# Altium project Control_Board.PrjPcb (part 2 of 7)

## Sheet Microcontroller.SchDoc
size A4; SheetNumber: 2; SheetTotal: 9
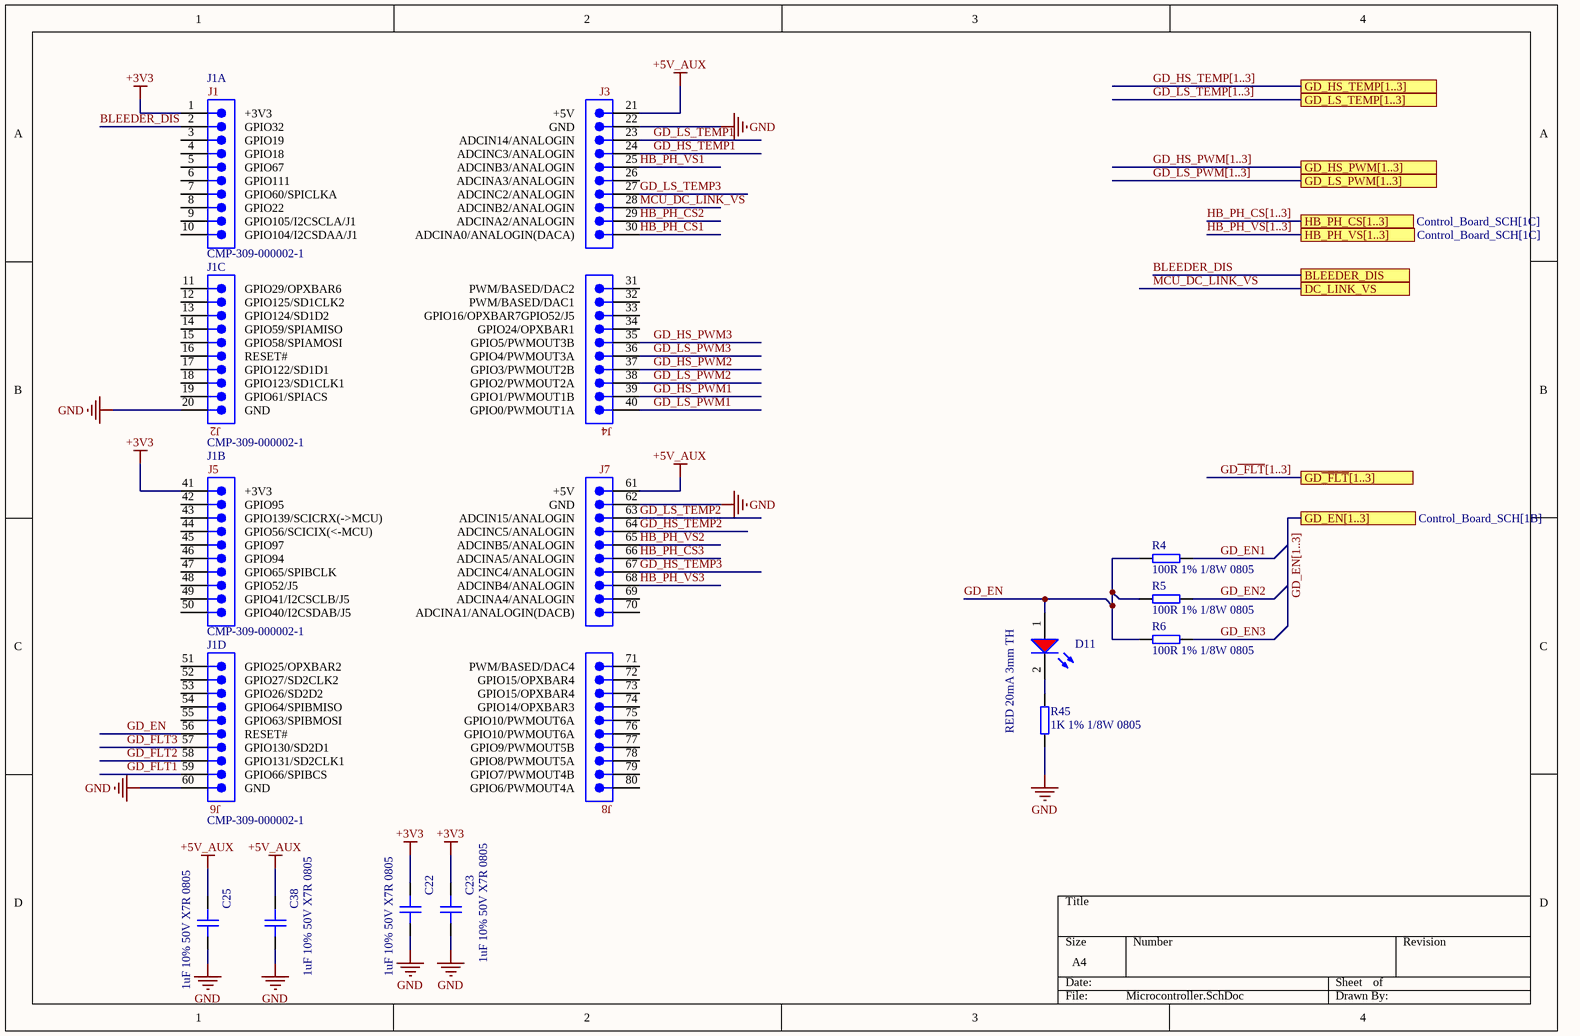
[diagram p2: Microcontroller.SchDoc]

### Parts
C22  1uF 10% 50V X7R 0805  [CAPC2012X10N]
C23  1uF 10% 50V X7R 0805  [CAPC2012X10N]
C25  1uF 10% 50V X7R 0805  [CAPC2012X10N]
C38  1uF 10% 50V X7R 0805  [CAPC2012X10N]
D11  RED 20mA 3mm TH  [WL-TMRC_D3.95H5.3]
J1  CMP-309-000002-1  [LAUNCHXL-F28379D]  (parts A,B,C,D of 4)
R4  100R 1% 1/8W 0805  [RESC2012X05N]
R5  100R 1% 1/8W 0805  [RESC2012X05N]
R6  100R 1% 1/8W 0805  [RESC2012X05N]
R45  1K 1% 1/8W 0805  [RESC2012X05N]

### Ports
BLEEDER_DIS (see Control_Board_SCH[1C], DC_Link[1B]), DC_LINK_VS (see Control_Board_SCH[1C], DC_Link_Sensing[1C]), GD_EN[1..3] (see Control_Board_SCH[1B]), GD_HS_PWM[1..3] (see Control_Board_SCH[1B]), GD_HS_TEMP[1..3] (see Control_Board_SCH[1B]), GD_LS_PWM[1..3] (see Control_Board_SCH[1B]), GD_LS_TEMP[1..3] (see Control_Board_SCH[1C]), GD~{_FLT}[1..3] (see Control_Board_SCH[1B]), HB_PH_CS[1..3] (see Control_Board_SCH[1C]), HB_PH_VS[1..3] (see Control_Board_SCH[1C])

### Nets
+3V3: C22.1 C23.1 J1.1(+3V3) J1.41(+3V3)
+5V_AUX: C25.1 C38.1 J1.21(+5V) J1.61(+5V)
GND: C22.2 C23.2 C25.2 C38.2 J1.20(GND) J1.22(GND) J1.60(GND) J1.62(GND) R45.1
BLEEDER_DIS: J1.2(GPIO32) ; port BLEEDER_DIS
GD~{_FLT}1: J1.59(GPIO66/SPIBCS)
GD~{_FLT}2: J1.58(GPIO131/SD2CLK1)
GD~{_FLT}3: J1.57(GPIO130/SD2D1)
GD_EN: D11.1(A) J1.56(RESET#) R4.1 R5.1 R6.1
GD_EN1: R4.2  [project net GD_EN]
GD_EN2: R5.2  [project net GD_EN]
GD_EN3: R6.2  [project net GD_EN]
GD_HS_PWM1: J1.39(GPIO1/PWMOUT1B)  [project net GD_HS_PWM]
GD_HS_PWM2: J1.37(GPIO3/PWMOUT2B)  [project net GD_HS_PWM]
GD_HS_PWM3: J1.35(GPIO5/PWMOUT3B)  [project net GD_HS_PWM]
GD_HS_TEMP1: J1.24(ADCINC3/ANALOGIN)  [project net GD_HS_TEMP]
GD_HS_TEMP2: J1.64(ADCINC5/ANALOGIN)  [project net GD_HS_TEMP]
GD_HS_TEMP3: J1.67(ADCINC4/ANALOGIN)  [project net GD_HS_TEMP]
GD_LS_PWM1: J1.40(GPIO0/PWMOUT1A)  [project net GD_LS_PWM]
GD_LS_PWM2: J1.38(GPIO2/PWMOUT2A)  [project net GD_LS_PWM]
GD_LS_PWM3: J1.36(GPIO4/PWMOUT3A)  [project net GD_LS_PWM]
GD_LS_TEMP1: J1.23(ADCIN14/ANALOGIN)  [project net GD_LS_TEMP]
GD_LS_TEMP2: J1.63(ADCIN15/ANALOGIN)  [project net GD_LS_TEMP]
GD_LS_TEMP3: J1.27(ADCINC2/ANALOGIN)  [project net GD_LS_TEMP]
HB_PH_CS1: J1.30(ADCINA0/ANALOGIN(DACA))  [project net HB_PH_CS]
HB_PH_CS2: J1.29(ADCINA2/ANALOGIN)  [project net HB_PH_CS]
HB_PH_CS3: J1.66(ADCINA5/ANALOGIN)  [project net HB_PH_CS]
HB_PH_VS1: J1.25(ADCINB3/ANALOGIN)  [project net HB_PH_VS]
HB_PH_VS2: J1.65(ADCINB5/ANALOGIN)  [project net HB_PH_VS]
HB_PH_VS3: J1.68(ADCINB4/ANALOGIN)  [project net HB_PH_VS]
MCU_DC_LINK_VS: J1.28(ADCINB2/ANALOGIN) ; port DC_LINK_VS
NetD11_2: D11.2(K) R45.2

Not connected (* = marked no-connect by the designer): J1 3(GPIO19) 4(GPIO18) 5(GPIO67) 6(GPIO111) 7(GPIO60/SPICLKA) 8(GPIO22) 9(GPIO105/I2CSCLA/J1) 10(GPIO104/I2CSDAA/J1) 11(GPIO29/OPXBAR6) 12(GPIO125/SD1CLK2) 13(GPIO124/SD1D2) 14(GPIO59/SPIAMISO) 15(GPIO58/SPIAMOSI) 16(RESET#) 17(GPIO122/SD1D1) 18(GPIO123/SD1CLK1) 19(GPIO61/SPIACS) 26(ADCINA3/ANALOGIN) 31(PWM/BASED/DAC2) 32(PWM/BASED/DAC1) 33(GPIO16/OPXBAR7GPIO52/J5) 34(GPIO24/OPXBAR1) 42(GPIO95) 43(GPIO139/SCICRX(->MCU)) 44(GPIO56/SCICIX(<-MCU)) 45(GPIO97) 46(GPIO94) 47(GPIO65/SPIBCLK) 48(GPIO52/J5) 49(GPIO41/I2CSCLB/J5) 50(GPIO40/I2CSDAB/J5) 51(GPIO25/OPXBAR2) 52(GPIO27/SD2CLK2) 53(GPIO26/SD2D2) 54(GPIO64/SPIBMISO) 55(GPIO63/SPIBMOSI) 69(ADCINA4/ANALOGIN) 70(ADCINA1/ANALOGIN(DACB)) 71(PWM/BASED/DAC4) 72(GPIO15/OPXBAR4) 73(GPIO15/OPXBAR4) 74(GPIO14/OPXBAR3) 75(GPIO10/PWMOUT6A) 76(GPIO10/PWMOUT6A) 77(GPIO9/PWMOUT5B) 78(GPIO8/PWMOUT5A) 79(GPIO7/PWMOUT4B) 80(GPIO6/PWMOUT4A)

### Buses and harness runs
bus GD_EN[1..3] = port GD_EN[1..3]
bus GD_HS_PWM[1..3] = port GD_HS_PWM[1..3]
bus GD_HS_TEMP[1..3] = port GD_HS_TEMP[1..3]
bus GD_LS_PWM[1..3] = port GD_LS_PWM[1..3]
bus GD_LS_TEMP[1..3] = port GD_LS_TEMP[1..3]
bus GD~{_FLT}[1..3] = port GD~{_FLT}[1..3]
bus HB_PH_CS[1..3] = port HB_PH_CS[1..3]
bus HB_PH_VS[1..3] = port HB_PH_VS[1..3]

### Notes on the sheet
- (in symbol CMP-309-000002-1, part A) J3
- (in symbol CMP-309-000002-1, part B) J5; J7
- (in symbol CMP-309-000002-1, part C) J2; J4
- (in symbol CMP-309-000002-1, part D) J6; J8

### Library data of the parts
C22 C23 C25 C38 = CMP-001-00047-1: Ceramic Capacitor, Multilayer, Ceramic, 50V, 10% +Tol, 10% -Tol, X7R, 15% TC, 1uF, Surface Mount, 0805; Manufacturer Part Number: C2012X7R1H105K125AB; Manufacturer Lifecycle Status: PRODUCTION; Manufacturer: TDK; Value: 1µF; Export Control Classification Number (ECCN) Code: EAR99; Case/Package: 0805; Max Length: 3.5mm; ComponentLink4Description: https://datasheet.octopart.com:443/C3216X7R1H106K160AC-TDK-datasheet-151546523.pdf?src-supplier=ODG+(Origin+Data+Global); ComponentLink1URL: https://datasheet.octopart.com:443/C3216X7R1H106K160AC-TDK-datasheet-175423548.pdf?src-supplier=TME; Category: Ceramic Capacitors; Voltage Rating (DC): 50V; Case Code (Metric): 2012; Lifecycle Status: Production; Height: 1.6mm; Design Item ID: 1uF 10% 50V X7R 0805; Min Length: 3.1mm; Min Operating Temperature: -55°C; Pricing: 100=3,09, 250=2,81, 500=2,35, 1000=2,2, 2000=1,97 (DKK); Width: 1.6mm; Voltage Rating: 50V; Stock: 26276; ComponentLink2Description: https://datasheet.octopart.com:443/C3216X7R1H106K160AC-TDK-datasheet-182135025.pdf?src-supplier=TME; Harmonized Tariff Schedule (HTS) Code: 8532.24.00.20; ComponentLink3Description: https://datasheet.octopart.com:443/C3216X7R1H106K160AC-TDK-datasheet-159617022.pdf?src-supplier=TME; Thickness: 1.6mm; Max Operating Temperature: 125°C; ComponentLink4URL: https://datasheet.octopart.com:443/C3216X7R1H106K160AC-TDK-datasheet-151546523.pdf?src-supplier=ODG+(Origin+Data+Global); Lead Free: Lead Free; ComponentLink3URL: https://datasheet.octopart.com:443/C3216X7R1H106K160AC-TDK-datasheet-159617022.pdf?src-supplier=TME; ComponentLink1Description: https://datasheet.octopart.com:443/C3216X7R1H106K160AC-TDK-datasheet-175423548.pdf?src-supplier=TME; Max Width: 1.9mm; Dielectric: X7R; RoHS: Compliant; China RoHS: Compliant; REACH SVHC: Yes; ComponentLink2URL: https://datasheet.octopart.com:443/C3216X7R1H106K160AC-TDK-datasheet-182135025.pdf?src-supplier=TME; Length: 3.2mm; ComponentLink5URL: https://datasheet.octopart.com/C3216X7R1H106K160AC-TDK-datasheet-41194876.pdf; Introduction Date: 2018-03-29; Dielectric Material: Ceramic; Min Width: 1.5mm; Number of Terminals: 2; Material: Ceramic; Source: MasterLibrary_SCH.SchLib; Mounting Technology: Surface Mount; ComponentLink5Description: https://datasheet.octopart.com/C3216X7R1H106K160AC-TDK-datasheet-41194876.pdf
D11 = CMP-007-00005-2: LED RED DIFFUSED 3MM ROUND T/H; Manufacturer: Wurth Elektronik; Manufacturer Part Number: 151031SS06000; Lens Style: Circular, Diffused, Round; Peak Wavelength: 650nm; Dominant Wavelength: 640nm; Max Reverse Voltage (DC): 5V; Luminous Intensity: 35mcd; Forward Voltage: 2.2V; Forward Current: 100mA; Max Operating Temperature: 85°C; Length: 3mm; Category: LEDs; RoHS: Compliant; Lens Size: 3mm; Height: 5.3mm; Test Current: 20mA; Color: Red; Min Operating Temperature: -40°C; Packaging: Bulk; Case/Package: Radial; Mount: Through Hole; REACH SVHC: Unknown
J1 = CMP-309-000002-1: F28379D LaunchPad™ development kit for C2000™ Delfino™ MCU; Manufacturer: Texas Instruments; Manufacturer Lifecycle Status: ACTIVE; Core Architecture: C2000; Number of Bits: 32; Manufacturer Part Number: LAUNCHXL-F28379D; Category: DSPs - Digital Signal Processors; Pricing: 1=46.8 (USD); Lifecycle Status: Production; Pins: 0; REACH SVHC: No; ComponentLink1URL: https://octopart.com:443/opatz8j6/c1?t=_qCjX2Wo53PZarO6BjGz1pzxvZLeCrbbVJACmNqqTvR3TEBVwYoGW-DXq5l11NPCyEyQmG2wH9P15DbxEwR5ZZHsyk33RBSXwUdEtCa7jNxIhSrryjNLEF-Vgre1piZzQz56aD2MK6QuEQpUtDRfErQs-_Fz2k06mrjKwHn2nJAT_YV2HxfigPUyr5srGnEy9lLlrNqGpcCNex5yYxUMkQXiFlqqbITrV8bFvInxDQ88sUGODQNtS64O8hVEwNdGa20kbIjdoqOBoaE1JHzrO901WwG08850-S2bXz9NSqERxo83_Q49v-k_oL6cPW0CHjrP4NMWOrNhAcehFalWX6jDFn3RYJBbH4wBv6PGCMA2lz1wT9CaKpwnDvEQJ5WJVjDawH1R7TR419iNQ7OBATXWz7I&src-supplier=Texas+Instruments; ComponentLink1Description: https://octopart.com:443/opatz8j6/c1?t=_qCjX2Wo53PZarO6BjGz1pzxvZLeCrbbVJACmNqqTvR3TEBVwYoGW-DXq5l11NPCyEyQmG2wH9P15DbxEwR5ZZHsyk33RBSXwUdEtCa7jNxIhSrryjNLEF-Vgre1piZzQz56aD2MK6QuEQpUtDRfErQs-_Fz2k06mrjKwHn2nJAT_YV2HxfigPUyr5srGnEy9lLlrNqGpcCNex5yYxUMkQXiFlqqbITrV8bFvInxDQ88sUGODQNtS64O8hVEwNdGa20kbIjdoqOBoaE1JHzrO901WwG08850-S2bXz9NSqERxo83_Q49v-k_oL6cPW0CHjrP4NMWOrNhAcehFalWX6jDFn3RYJBbH4wBv6PGCMA2lz1wT9CaKpwnDvEQJ5WJVjDawH1R7TR419iNQ7OBATXWz7I&src-supplier=Texas+Instruments; ComponentLink2URL: https://datasheet.octopart.com:443/LAUNCHXL-F28379D-Texas-Instruments-datasheet-152741484.pdf?src-supplier=ODG+(Origin+Data+Global); ComponentLink2Description: https://datasheet.octopart.com:443/LAUNCHXL-F28379D-Texas-Instruments-datasheet-152741484.pdf?src-supplier=ODG+(Origin+Data+Global); ComponentLink3URL: https://datasheet.octopart.com:443/LAUNCHXL-F28379D-Texas-Instruments-datasheet-67294821.pdf?src-supplier=element14+APAC; ComponentLink3Description: https://datasheet.octopart.com:443/LAUNCHXL-F28379D-Texas-Instruments-datasheet-67294821.pdf?src-supplier=element14+APAC; ComponentLink4URL: https://datasheet.octopart.com:443/LAUNCHXL-F28379D-Texas-Instruments-datasheet-103777603.pdf?src-supplier=TME; ComponentLink4Description: https://datasheet.octopart.com:443/LAUNCHXL-F28379D-Texas-Instruments-datasheet-103777603.pdf?src-supplier=TME; ComponentLink5URL: http://sigma.octopart.com:80/reach_statement/Texas-Instruments-company-64.pdf?src-supplier=Compliance+Statements; ComponentLink5Description: http://sigma.octopart.com:80/reach_statement/Texas-Instruments-company-64.pdf?src-supplier=Compliance+Statements; ComponentLink6URL: http://sigma.octopart.com:80/conflict_mineral_statement/Texas-Instruments-company-63.pdf?src-supplier=Compliance+Statements; ComponentLink6Description: http://sigma.octopart.com:80/conflict_mineral_statement/Texas-Instruments-company-63.pdf?src-supplier=Compliance+Statements; ComponentLink7URL: https://octopart.com:443/opatz8j6/c1?t=vmM5mUkauSidLfiIfngj-A2eh6SjcyeYQ_18RxJ-XgRT5PFLOln341s3Da68ti8m6yMC8JyHE5YCQ8oxmljwW8O_iXgryuhhxmjCmpHtdr4VDwYtt48MgbKj-slNB3Nj0mMH04CuEmFmw_fUmAswlWbCu5ZMAg5-39dPO4IMZ0IkEkvJqqV3lhWtLIq7mSnDMHN61-x5vEZotwGXpDkhXVPdiQUwVwsuDPl99fprXnUSUtNA7saaZFRkXjg1cuiRBuIcQzdWjl70NXHJ-qE7RXDui7Y0LCAu6IeHkA&src-supplier=Compliance+Statements; ComponentLink7Description: https://octopart.com:443/opatz8j6/c1?t=vmM5mUkauSidLfiIfngj-A2eh6SjcyeYQ_18RxJ-XgRT5PFLOln341s3Da68ti8m6yMC8JyHE5YCQ8oxmljwW8O_iXgryuhhxmjCmpHtdr4VDwYtt48MgbKj-slNB3Nj0mMH04CuEmFmw_fUmAswlWbCu5ZMAg5-39dPO4IMZ0IkEkvJqqV3lhWtLIq7mSnDMHN61-x5vEZotwGXpDkhXVPdiQUwVwsuDPl99fprXnUSUtNA7saaZFRkXjg1cuiRBuIcQzdWjl70NXHJ-qE7RXDui7Y0LCAu6IeHkA&src-supplier=Compliance+Statements; Quantity: 4; Design Item ID: CON80: LAUNCHXL-F28379D; Source: MasterLibrary_SCH.SchLib
R4-R6 = CMP-009-00668-1: Res Thick Film 0805 100 Ohm 1% 0.125W ±100ppm/°C Molded SMD Paper T/R; Manufacturer Part Number: RMCF0805FT100R; Manufacturer: Stackpole Electronics; Working Voltage: 150V; Power Rating: 125mW; Value: 100; Features: Automotive AEC-Q200; Lifecycle Status: Production; ComponentLink10URL: https://datasheet.octopart.com:443/RMCF0805FT10K0-Stackpole-Electronics-datasheet-11547379.pdf?src-supplier=Future+Electronics; Case Code (Metric): 2012; ComponentLink16URL: http://sigma.octopart.com:80/141158211/reach_statement/Stackpole-Electronics-RMCF0805FT10K0.pdf?src-supplier=Compliance+Statements; ComponentLink14URL: https://datasheet.octopart.com:443/RMCF0805FT10K0-Stackpole-Electronics-datasheet-5313682.pdf?src-supplier=Future+Electronics; ComponentLink6URL: https://datasheet.octopart.com:443/RMCF0805FT10K0-Stackpole-Electronics-datasheet-62091608.pdf?src-supplier=Stackpole+Electronics; ComponentLink3URL: https://datasheet.octopart.com:443/RMCF0805FT10K0-Stackpole-Electronics-datasheet-28504820.pdf?src-supplier=Upverter; Design Item ID: 100R 1% 1/8W 0805; Mounting Technology: Surface Mount; ComponentLink9URL: https://datasheet.octopart.com:443/RMCF0805FT10K0-Stackpole-Electronics-datasheet-11546843.pdf?src-supplier=Arrow+Electronics; ComponentLink2Description: https://datasheet.octopart.com:443/RMCF0805FT10K0-Stackpole-Electronics-datasheet-12534581.pdf?src-supplier=Upverter; Voltage Rating: 150V; ComponentLink17Description: http://sigma.octopart.com:80/141158212/rohs_statement/Stackpole-Electronics-RMCF0805FT10K0.pdf?src-supplier=Compliance+Statements; Stock: 3420000; Number of Terminations: 2; Contact Plating: Tin; ComponentLink1Description: https://datasheet.octopart.com:443/RMCF0805FT10K0-Stackpole-Electronics-datasheet-182148065.pdf?src-supplier=IHS; ComponentLink2URL: https://datasheet.octopart.com:443/RMCF0805FT10K0-Stackpole-Electronics-datasheet-12534581.pdf?src-supplier=Upverter; Source: MasterLibrary_SCH.SchLib; Length: 2mm; ComponentLink13Description: https://datasheet.octopart.com:443/RMCF0805FT10K0-Stackpole-Electronics-datasheet-8088878.pdf?src-supplier=Future+Electronics; Lead Free: Lead Free; Category: Chip SMD Resistors; Composition: Thick Film; Tolerance: 1%; Schedule B: 8533210045, 8533210045; RoHS: Compliant; ComponentLink15URL: http://sigma.octopart.com:80/15940719/materials_sheet/Stackpole-Electronics-RMCF0805FT10K0.pdf?src-supplier=Compliance+Statements; Case/Package: 0805; Pricing: 5000=0.00245, 10000=0.00241, 20000=0.00238, 40000=0.00234, 80000=0.0023 (USD); ComponentLink8Description: https://datasheet.octopart.com:443/RMCF0805FT10K0-Stackpole-Electronics-datasheet-154799224.pdf?src-supplier=Master+Electronics; ComponentLink11Description: https://datasheet.octopart.com:443/RMCF0805FT10K0-Stackpole-Electronics-datasheet-8359789.pdf?src-supplier=Future+Electronics; China RoHS: Non-Compliant; Height: 500µm; ComponentLink9Description: https://datasheet.octopart.com:443/RMCF0805FT10K0-Stackpole-Electronics-datasheet-11546843.pdf?src-supplier=Arrow+Electronics; ComponentLink8URL: https://datasheet.octopart.com:443/RMCF0805FT10K0-Stackpole-Electronics-datasheet-154799224.pdf?src-supplier=Master+Electronics; ComponentLink12Description: https://datasheet.octopart.com:443/RMCF0805FT10K0-Stackpole-Electronics-datasheet-8324226.pdf?src-supplier=Future+Electronics; Temperature Coefficient: 100ppm/°C; ComponentLink12URL: https://datasheet.octopart.com:443/RMCF0805FT10K0-Stackpole-Electronics-datasheet-8324226.pdf?src-supplier=Future+Electronics; Number of Terminals: 2; Depth: 1.25mm; ComponentLink7Description: https://datasheet.octopart.com:443/RMCF0805FT10K0-Stackpole-Electronics-datasheet-10788263.pdf?src-supplier=Stackpole+Electronics; ComponentLink15Description: http://sigma.octopart.com:80/15940719/materials_sheet/Stackpole-Electronics-RMCF0805FT10K0.pdf?src-supplier=Compliance+Statements; ComponentLink6Description: https://datasheet.octopart.com:443/RMCF0805FT10K0-Stackpole-Electronics-datasheet-62091608.pdf?src-supplier=Stackpole+Electronics; Packaging: Cut Tape (CT); Max Operating Temperature: 155°C; ComponentLink7URL: https://datasheet.octopart.com:443/RMCF0805FT10K0-Stackpole-Electronics-datasheet-10788263.pdf?src-supplier=Stackpole+Electronics; ComponentLink16Description: http://sigma.octopart.com:80/141158211/reach_statement/Stackpole-Electronics-RMCF0805FT10K0.pdf?src-supplier=Compliance+Statements; Width: 1.25mm; Power Dissipation: 125mW; ComponentLink5Description: https://datasheet.octopart.com:443/RMCF0805FT10K0-Stackpole-Electronics-datasheet-141193804.pdf?src-supplier=Stackpole+Electronics; Radiation Hardening: No; Military Standard: Not; Min Operating Temperature: -55°C; ComponentLink11URL: https://datasheet.octopart.com:443/RMCF0805FT10K0-Stackpole-Electronics-datasheet-8359789.pdf?src-supplier=Future+Electronics; ComponentLink3Description: https://datasheet.octopart.com:443/RMCF0805FT10K0-Stackpole-Electronics-datasheet-28504820.pdf?src-supplier=Upverter; REACH SVHC: Yes; ComponentLink4Description: https://datasheet.octopart.com:443/RMCF0805FT10K0-Stackpole-Electronics-datasheet-12510902.pdf?src-supplier=Upverter; ComponentLink10Description: https://datasheet.octopart.com:443/RMCF0805FT10K0-Stackpole-Electronics-datasheet-11547379.pdf?src-supplier=Future+Electronics; ComponentLink5URL: https://datasheet.octopart.com:443/RMCF0805FT10K0-Stackpole-Electronics-datasheet-141193804.pdf?src-supplier=Stackpole+Electronics; Max Power Dissipation: 125mW; ComponentLink13URL: https://datasheet.octopart.com:443/RMCF0805FT10K0-Stackpole-Electronics-datasheet-8088878.pdf?src-supplier=Future+Electronics; ComponentLink17URL: http://sigma.octopart.com:80/141158212/rohs_statement/Stackpole-Electronics-RMCF0805FT10K0.pdf?src-supplier=Compliance+Statements; ComponentLink14Description: https://datasheet.octopart.com:443/RMCF0805FT10K0-Stackpole-Electronics-datasheet-5313682.pdf?src-supplier=Future+Electronics; ComponentLink4URL: https://datasheet.octopart.com:443/RMCF0805FT10K0-Stackpole-Electronics-datasheet-12510902.pdf?src-supplier=Upverter; ComponentLink1URL: https://datasheet.octopart.com:443/RMCF0805FT10K0-Stackpole-Electronics-datasheet-182148065.pdf?src-supplier=IHS
R45 = CMP-009-00648-1: Res Thick Film 0805 1K Ohm 1% 0.125W ±100ppm/°C Molded SMD Paper T/R; Manufacturer: Stackpole Electronics; Manufacturer Part Number: RMCF0805FT1K00; Power Dissipation: 125mW; Working Voltage: 150V; ComponentLink4Description: https://datasheet.octopart.com:443/RMCF0805FT10K0-Stackpole-Electronics-datasheet-12510902.pdf?src-supplier=Upverter; Tolerance: 1%; ComponentLink7Description: https://datasheet.octopart.com:443/RMCF0805FT10K0-Stackpole-Electronics-datasheet-10788263.pdf?src-supplier=Stackpole+Electronics; Category: Chip SMD Resistors; Pricing: 5000=0.00245, 10000=0.00241, 20000=0.00238, 40000=0.00234, 80000=0.0023 (USD); RoHS: Compliant; Packaging: Cut Tape (CT); Width: 1.25mm; ComponentLink12URL: https://datasheet.octopart.com:443/RMCF0805FT10K0-Stackpole-Electronics-datasheet-8324226.pdf?src-supplier=Future+Electronics; Temperature Coefficient: 100ppm/°C; Lifecycle Status: Production; Mounting Technology: Surface Mount; ComponentLink6Description: https://datasheet.octopart.com:443/RMCF0805FT10K0-Stackpole-Electronics-datasheet-62091608.pdf?src-supplier=Stackpole+Electronics; Number of Terminals: 2; ComponentLink1Description: https://datasheet.octopart.com:443/RMCF0805FT10K0-Stackpole-Electronics-datasheet-182148065.pdf?src-supplier=IHS; REACH SVHC: Yes; ComponentLink4URL: https://datasheet.octopart.com:443/RMCF0805FT10K0-Stackpole-Electronics-datasheet-12510902.pdf?src-supplier=Upverter; Power Rating: 125mW; Value: 1k; ComponentLink13URL: https://datasheet.octopart.com:443/RMCF0805FT10K0-Stackpole-Electronics-datasheet-8088878.pdf?src-supplier=Future+Electronics; ComponentLink10Description: https://datasheet.octopart.com:443/RMCF0805FT10K0-Stackpole-Electronics-datasheet-11547379.pdf?src-supplier=Future+Electronics; ComponentLink12Description: https://datasheet.octopart.com:443/RMCF0805FT10K0-Stackpole-Electronics-datasheet-8324226.pdf?src-supplier=Future+Electronics; ComponentLink2Description: https://datasheet.octopart.com:443/RMCF0805FT10K0-Stackpole-Electronics-datasheet-12534581.pdf?src-supplier=Upverter; Number of Terminations: 2; ComponentLink17URL: http://sigma.octopart.com:80/141158212/rohs_statement/Stackpole-Electronics-RMCF0805FT10K0.pdf?src-supplier=Compliance+Statements; Contact Plating: Tin; ComponentLink9URL: https://datasheet.octopart.com:443/RMCF0805FT10K0-Stackpole-Electronics-datasheet-11546843.pdf?src-supplier=Arrow+Electronics; ComponentLink17Description: http://sigma.octopart.com:80/141158212/rohs_statement/Stackpole-Electronics-RMCF0805FT10K0.pdf?src-supplier=Compliance+Statements; ComponentLink2URL: https://datasheet.octopart.com:443/RMCF0805FT10K0-Stackpole-Electronics-datasheet-12534581.pdf?src-supplier=Upverter; Case Code (Metric): 2012; ComponentLink8Description: https://datasheet.octopart.com:443/RMCF0805FT10K0-Stackpole-Electronics-datasheet-154799224.pdf?src-supplier=Master+Electronics; ComponentLink11Description: https://datasheet.octopart.com:443/RMCF0805FT10K0-Stackpole-Electronics-datasheet-8359789.pdf?src-supplier=Future+Electronics; ComponentLink5Description: https://datasheet.octopart.com:443/RMCF0805FT10K0-Stackpole-Electronics-datasheet-141193804.pdf?src-supplier=Stackpole+Electronics; ComponentLink11URL: https://datasheet.octopart.com:443/RMCF0805FT10K0-Stackpole-Electronics-datasheet-8359789.pdf?src-supplier=Future+Electronics; Height: 500µm; ComponentLink1URL: https://datasheet.octopart.com:443/RMCF0805FT10K0-Stackpole-Electronics-datasheet-182148065.pdf?src-supplier=IHS; Length: 2mm; ComponentLink16Description: http://sigma.octopart.com:80/141158211/reach_statement/Stackpole-Electronics-RMCF0805FT10K0.pdf?src-supplier=Compliance+Statements; ComponentLink6URL: https://datasheet.octopart.com:443/RMCF0805FT10K0-Stackpole-Electronics-datasheet-62091608.pdf?src-supplier=Stackpole+Electronics; Schedule B: 8533210045, 8533210045; ComponentLink14URL: https://datasheet.octopart.com:443/RMCF0805FT10K0-Stackpole-Electronics-datasheet-5313682.pdf?src-supplier=Future+Electronics; Stock: 3420000; ComponentLink14Description: https://datasheet.octopart.com:443/RMCF0805FT10K0-Stackpole-Electronics-datasheet-5313682.pdf?src-supplier=Future+Electronics; Features: Automotive AEC-Q200; China RoHS: Non-Compliant; ComponentLink13Description: https://datasheet.octopart.com:443/RMCF0805FT10K0-Stackpole-Electronics-datasheet-8088878.pdf?src-supplier=Future+Electronics; Voltage Rating: 150V; Radiation Hardening: No; Source: MasterLibrary_SCH.SchLib; ComponentLink8URL: https://datasheet.octopart.com:443/RMCF0805FT10K0-Stackpole-Electronics-datasheet-154799224.pdf?src-supplier=Master+Electronics; Max Operating Temperature: 155°C; Design Item ID: 1K 1% 1/8W 0805; ComponentLink15Description: http://sigma.octopart.com:80/15940719/materials_sheet/Stackpole-Electronics-RMCF0805FT10K0.pdf?src-supplier=Compliance+Statements; ComponentLink5URL: https://datasheet.octopart.com:443/RMCF0805FT10K0-Stackpole-Electronics-datasheet-141193804.pdf?src-supplier=Stackpole+Electronics; ComponentLink15URL: http://sigma.octopart.com:80/15940719/materials_sheet/Stackpole-Electronics-RMCF0805FT10K0.pdf?src-supplier=Compliance+Statements; Lead Free: Lead Free; Case/Package: 0805; Max Power Dissipation: 125mW; ComponentLink10URL: https://datasheet.octopart.com:443/RMCF0805FT10K0-Stackpole-Electronics-datasheet-11547379.pdf?src-supplier=Future+Electronics; ComponentLink7URL: https://datasheet.octopart.com:443/RMCF0805FT10K0-Stackpole-Electronics-datasheet-10788263.pdf?src-supplier=Stackpole+Electronics; Min Operating Temperature: -55°C; ComponentLink9Description: https://datasheet.octopart.com:443/RMCF0805FT10K0-Stackpole-Electronics-datasheet-11546843.pdf?src-supplier=Arrow+Electronics; Depth: 1.25mm; Military Standard: Not; ComponentLink16URL: http://sigma.octopart.com:80/141158211/reach_statement/Stackpole-Electronics-RMCF0805FT10K0.pdf?src-supplier=Compliance+Statements; ComponentLink3URL: https://datasheet.octopart.com:443/RMCF0805FT10K0-Stackpole-Electronics-datasheet-28504820.pdf?src-supplier=Upverter; ComponentLink3Description: https://datasheet.octopart.com:443/RMCF0805FT10K0-Stackpole-Electronics-datasheet-28504820.pdf?src-supplier=Upverter; Composition: Thick Film